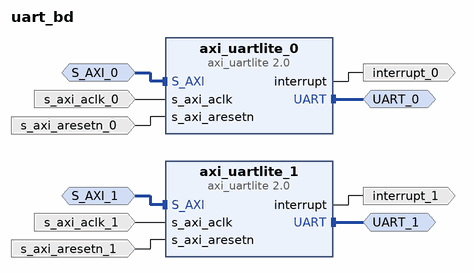
[diagram p0: block diagram of the top level]
# Vivado block design uart_bd, xczu7ev-ffvc1156-2-e, Vivado 2021.1
create_bd_design uart_bd

create_bd_intf_port -mode Slave -vlnv xilinx.com:interface:aximm_rtl:1.0 S_AXI_0
set_property -dict [list \
  CONFIG.ADDR_WIDTH 16 \
  CONFIG.ARUSER_WIDTH 0 \
  CONFIG.AWUSER_WIDTH 0 \
  CONFIG.BUSER_WIDTH 0 \
  CONFIG.DATA_WIDTH 32 \
  CONFIG.HAS_BRESP 1 \
  CONFIG.HAS_BURST 0 \
  CONFIG.HAS_CACHE 0 \
  CONFIG.HAS_LOCK 0 \
  CONFIG.HAS_PROT 0 \
  CONFIG.HAS_QOS 0 \
  CONFIG.HAS_REGION 0 \
  CONFIG.HAS_RRESP 1 \
  CONFIG.HAS_WSTRB 1 \
  CONFIG.ID_WIDTH 0 \
  CONFIG.MAX_BURST_LENGTH 1 \
  CONFIG.NUM_READ_OUTSTANDING 1 \
  CONFIG.NUM_READ_THREADS 1 \
  CONFIG.NUM_WRITE_OUTSTANDING 1 \
  CONFIG.NUM_WRITE_THREADS 1 \
  CONFIG.PROTOCOL AXI4LITE \
  CONFIG.READ_WRITE_MODE READ_WRITE \
  CONFIG.RUSER_BITS_PER_BYTE 0 \
  CONFIG.RUSER_WIDTH 0 \
  CONFIG.SUPPORTS_NARROW_BURST 0 \
  CONFIG.WUSER_BITS_PER_BYTE 0 \
  CONFIG.WUSER_WIDTH 0 \
] [get_bd_intf_ports S_AXI_0]
create_bd_intf_port -mode Master -vlnv xilinx.com:interface:uart_rtl:1.0 UART_0
create_bd_intf_port -mode Slave -vlnv xilinx.com:interface:aximm_rtl:1.0 S_AXI_1
set_property -dict [list \
  CONFIG.ADDR_WIDTH 16 \
  CONFIG.ARUSER_WIDTH 0 \
  CONFIG.AWUSER_WIDTH 0 \
  CONFIG.BUSER_WIDTH 0 \
  CONFIG.DATA_WIDTH 32 \
  CONFIG.HAS_BRESP 1 \
  CONFIG.HAS_BURST 0 \
  CONFIG.HAS_CACHE 0 \
  CONFIG.HAS_LOCK 0 \
  CONFIG.HAS_PROT 0 \
  CONFIG.HAS_QOS 0 \
  CONFIG.HAS_REGION 0 \
  CONFIG.HAS_RRESP 1 \
  CONFIG.HAS_WSTRB 1 \
  CONFIG.ID_WIDTH 0 \
  CONFIG.MAX_BURST_LENGTH 1 \
  CONFIG.NUM_READ_OUTSTANDING 1 \
  CONFIG.NUM_READ_THREADS 1 \
  CONFIG.NUM_WRITE_OUTSTANDING 1 \
  CONFIG.NUM_WRITE_THREADS 1 \
  CONFIG.PROTOCOL AXI4LITE \
  CONFIG.READ_WRITE_MODE READ_WRITE \
  CONFIG.RUSER_BITS_PER_BYTE 0 \
  CONFIG.RUSER_WIDTH 0 \
  CONFIG.SUPPORTS_NARROW_BURST 0 \
  CONFIG.WUSER_BITS_PER_BYTE 0 \
  CONFIG.WUSER_WIDTH 0 \
] [get_bd_intf_ports S_AXI_1]
create_bd_intf_port -mode Master -vlnv xilinx.com:interface:uart_rtl:1.0 UART_1
create_bd_port -dir O -type intr interrupt_0
create_bd_port -dir I -type clk s_axi_aclk_0
create_bd_port -dir I -type rst s_axi_aresetn_0
create_bd_port -dir O -type intr interrupt_1
create_bd_port -dir I -type clk s_axi_aclk_1
create_bd_port -dir I -type rst s_axi_aresetn_1

create_bd_cell -type ip -vlnv xilinx.com:ip:axi_uartlite:2.0 axi_uartlite_0
set_property -dict [list \
  CONFIG.C_BAUDRATE 230400 \
  CONFIG.C_S_AXI_ACLK_FREQ_HZ 250000000 \
  CONFIG.C_S_AXI_ACLK_FREQ_HZ_d 250 \
] [get_bd_cells axi_uartlite_0]
create_bd_cell -type ip -vlnv xilinx.com:ip:axi_uartlite:2.0 axi_uartlite_1
set_property -dict [list \
  CONFIG.C_BAUDRATE 230400 \
  CONFIG.C_S_AXI_ACLK_FREQ_HZ 250000000 \
  CONFIG.C_S_AXI_ACLK_FREQ_HZ_d 250 \
] [get_bd_cells axi_uartlite_1]

# ---- connections ----

connect_bd_intf_net -intf_net S_AXI_0_1 [get_bd_intf_ports S_AXI_0] [get_bd_intf_pins axi_uartlite_0/S_AXI]
connect_bd_intf_net -intf_net S_AXI_1_1 [get_bd_intf_ports S_AXI_1] [get_bd_intf_pins axi_uartlite_1/S_AXI]
connect_bd_intf_net [get_bd_intf_ports UART_0] [get_bd_intf_pins axi_uartlite_0/UART]
connect_bd_intf_net [get_bd_intf_ports UART_1] [get_bd_intf_pins axi_uartlite_1/UART]
connect_bd_net [get_bd_pins axi_uartlite_0/interrupt] [get_bd_ports interrupt_0]
connect_bd_net [get_bd_pins axi_uartlite_1/interrupt] [get_bd_ports interrupt_1]
connect_bd_net -net s_axi_aclk_0_1 [get_bd_ports s_axi_aclk_0] [get_bd_pins axi_uartlite_0/s_axi_aclk]
connect_bd_net -net s_axi_aclk_1_1 [get_bd_ports s_axi_aclk_1] [get_bd_pins axi_uartlite_1/s_axi_aclk]
connect_bd_net -net s_axi_aresetn_0_1 [get_bd_ports s_axi_aresetn_0] [get_bd_pins axi_uartlite_0/s_axi_aresetn]
connect_bd_net -net s_axi_aresetn_1_1 [get_bd_ports s_axi_aresetn_1] [get_bd_pins axi_uartlite_1/s_axi_aresetn]

# ---- address map ----
assign_bd_address -offset 0x0000 -range 4K -target_address_space [get_bd_addr_spaces S_AXI_0] [get_bd_addr_segs axi_uartlite_0/S_AXI/Reg]
assign_bd_address -offset 0x0000 -range 4K -target_address_space [get_bd_addr_spaces S_AXI_1] [get_bd_addr_segs axi_uartlite_1/S_AXI/Reg]

validate_bd_design
save_bd_design
